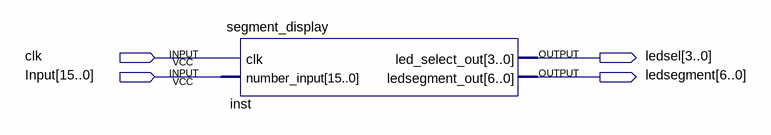
[diagram p0: schematic sheet]
// Quartus schematic display_test.bdf as structural Verilog: 1 symbols, 4 pins
module display_test (
  input  clk,
  input  [15:0] Input,
  output [3:0] ledsel,
  output [6:0] ledsegment
);

  segment_display inst (.clk(clk), .number_input(Input), .led_select_out(ledsel), .ledsegment_out(ledsegment));
endmodule
